# Altium schematic sheet 4_Drivers.schdoc
size 309 x 223 mm; Symbol: Sheet-Symbol_A4; Device: Sheet-Symbol_A4; Company: EasyEDA.com; Drawed: EasyEDA Pro; Reviewed: EasyEDA Pro; Version: V0.1; Page Size: A4; @Project Name: Robomama_ver000; @Page Count: 5; @Update Date: 2024-01-30; @Create Date: 2024-01-06; @Schematic Name: Robomama_Schematic; Part Number: JLCPCB-002; @Page No: 4; @Page Name: Drivers
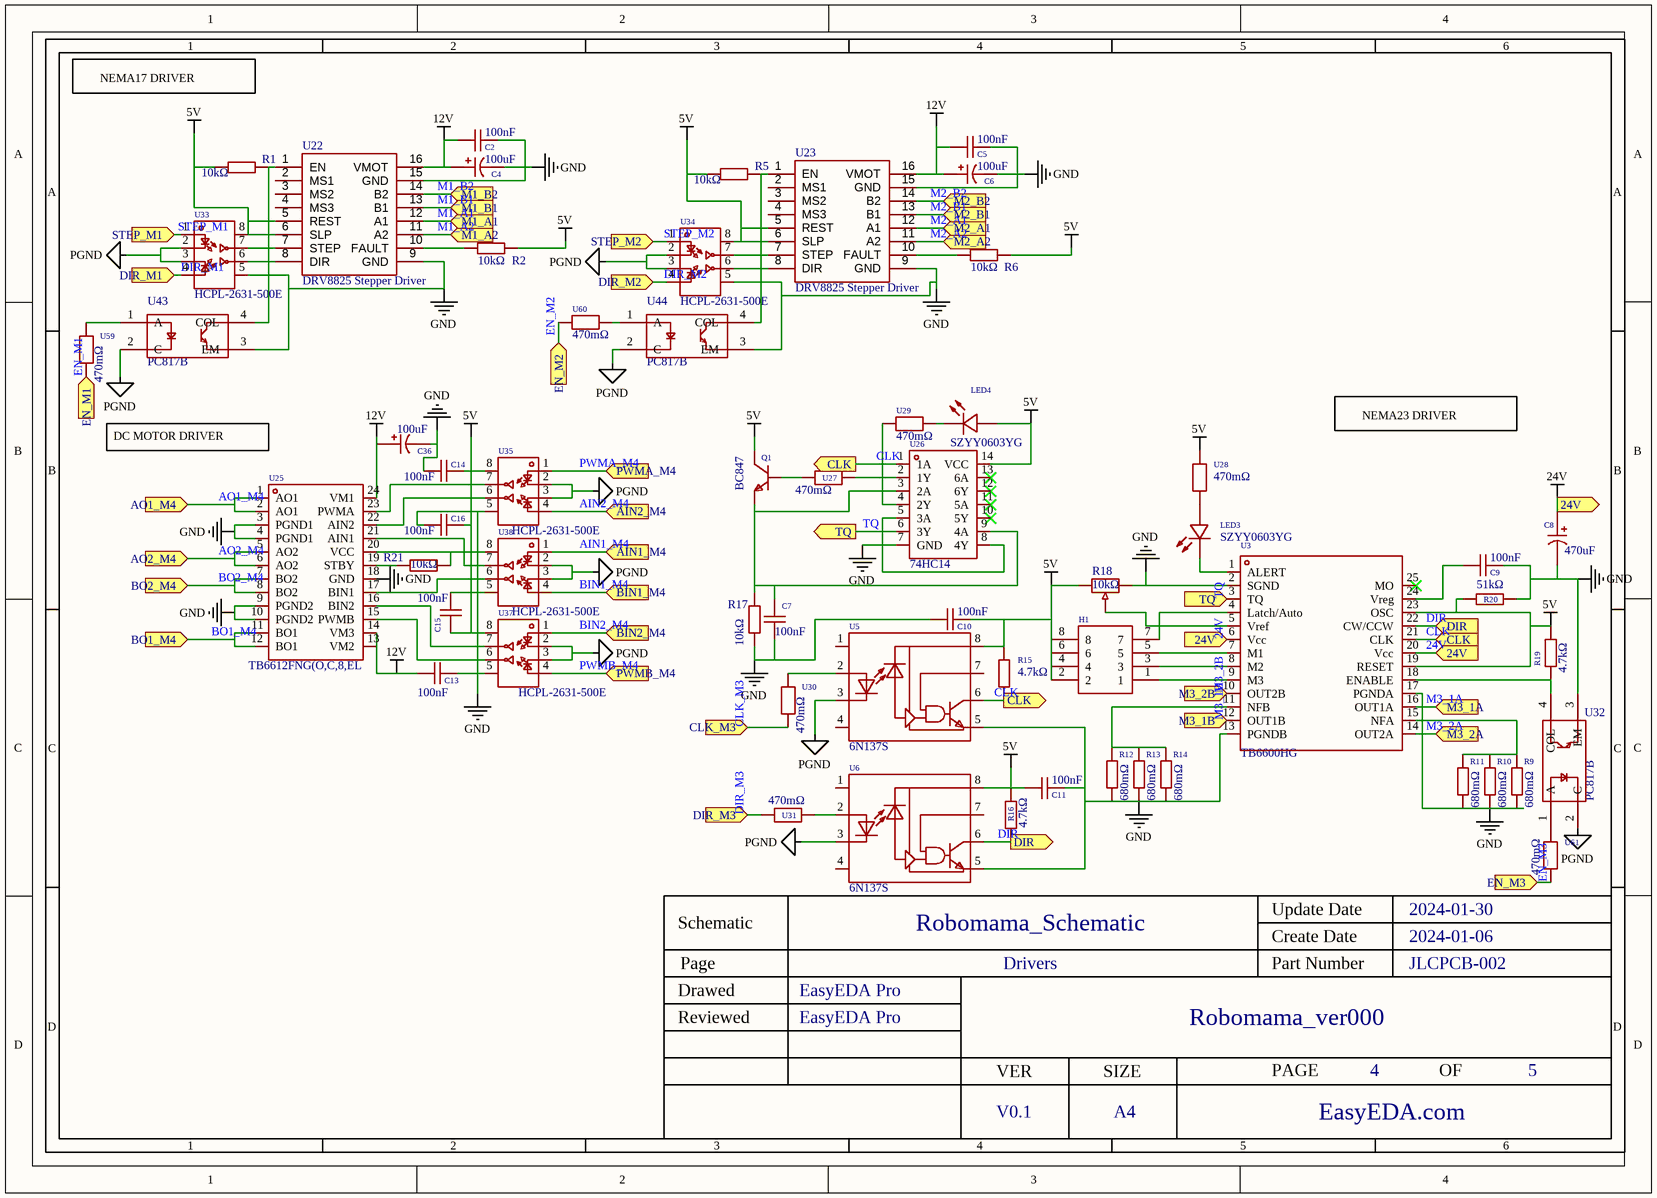
[diagram p0: 4_Drivers.schdoc]

## Parts
C2  100nF  [C0603]  (value not drawn)
C4  100uF  [CAP-SMD_BD6.3-L6.6-W6.6-LS7.2-FD]  (value not drawn)
C5  100nF  [C0603]  (value not drawn)
C6  100uF  [CAP-SMD_BD6.3-L6.6-W6.6-LS7.2-FD]  (value not drawn)
C7  100nF  [C0603]  (value not drawn)
C8  470uF  [CAP-SMD_BD12.5-L13.0-W13.0-LS14.0-FD]  (value not drawn)
C9  100nF  [C0603]  (value not drawn)
C10  100nF  [C0603]  (value not drawn)
C11  100nF  [C0603]  (value not drawn)
C13  100nF  [C0603]  (value not drawn)
C14  100nF  [C0603]  (value not drawn)
C15  100nF  [C0603]  (value not drawn)
C16  100nF  [C0603]  (value not drawn)
C36  100uF  [CAP-SMD_BD6.3-L6.6-W6.6-LS7.2-FD]  (value not drawn)
H1  68602-108HLF  [HDR-TH_8P-P2.54-V-M-R2-C4-S2.54]  (value not drawn)
LED3  SZYY0603YG  [LED0603-R-RD_GREEN]  (value not drawn)
LED4  SZYY0603YG  [LED0603-R-RD_GREEN]  (value not drawn)
Q1  BC847  [SOT-23-3_L2.9-W1.3-P1.90-LS2.4-BR]  (value not drawn)
R1  10kΩ  [R0603]  (value not drawn)
R2  10kΩ  [R0603]  (value not drawn)
R5  10kΩ  [R0603]  (value not drawn)
R6  10kΩ  [R0603]  (value not drawn)
R9  680mΩ  [R1206]  (value not drawn)
R10  680mΩ  [R1206]  (value not drawn)
R11  680mΩ  [R1206]  (value not drawn)
R12  680mΩ  [R1206]  (value not drawn)
R13  680mΩ  [R1206]  (value not drawn)
R14  680mΩ  [R1206]  (value not drawn)
R15  4.7kΩ  [R0402]  (value not drawn)
R16  4.7kΩ  [R0402]  (value not drawn)
R17  10kΩ  [R0603]  (value not drawn)
R18  10kΩ  [RES-ADJ-TH_3P-L9.6-W4.8-P2.50-R]  (value not drawn)
R19  4.7kΩ  [R0402]  (value not drawn)
R20  51kΩ  [R0603]  (value not drawn)
R21  10kΩ  [R0603]  (value not drawn)
U3  TB6600HG  [HZIP25-P-1.0_TB6600HG]  (value not drawn)
U5  6N137S  [SOP-8_L9.8-W6.6-P2.54-LS10.3-BL]  (value not drawn)
U6  6N137S  [SOP-8_L9.8-W6.6-P2.54-LS10.3-BL]  (value not drawn)
U22  DRV8825 Stepper Driver  [DRV8825]  (value not drawn)
U23  DRV8825 Stepper Driver  [DRV8825]  (value not drawn)
U25  TB6612FNG(O,C,8,EL  [SSOP-24_L8.4-W5.8-P0.65-LS7.8-BL]  (value not drawn)
U26  74HC14  [SOIC-14_L8.7-W3.9-P1.27-LS6.0-BL]  (value not drawn)
U27  470mΩ  [R0603]  (value not drawn)
U28  470mΩ  [R0603]  (value not drawn)
U29  470mΩ  [R0603]  (value not drawn)
U30  470mΩ  [R0603]  (value not drawn)
U31  470mΩ  [R0603]  (value not drawn)
U32  PC817B  [OPTO-SMD-4_L4.6-W6.5-P2.54-LS10.3-TL]  (value not drawn)
U33  HCPL-2631-500E  [OPTO-SMD-8P_L9.7-W6.4-P2.54-LS9.7-BL]  (value not drawn)
U34  HCPL-2631-500E  [OPTO-SMD-8P_L9.7-W6.4-P2.54-LS9.7-BL]  (value not drawn)
U35  HCPL-2631-500E  [OPTO-SMD-8P_L9.7-W6.4-P2.54-LS9.7-BL]  (value not drawn)
U37  HCPL-2631-500E  [OPTO-SMD-8P_L9.7-W6.4-P2.54-LS9.7-BL]  (value not drawn)
U38  HCPL-2631-500E  [OPTO-SMD-8P_L9.7-W6.4-P2.54-LS9.7-BL]  (value not drawn)
U43  PC817B  [OPTO-SMD-4_L4.6-W6.5-P2.54-LS10.3-TL]  (value not drawn)
U44  PC817B  [OPTO-SMD-4_L4.6-W6.5-P2.54-LS10.3-TL]  (value not drawn)
U59  470mΩ  [R0603]  (value not drawn)
U60  470mΩ  [R0603]  (value not drawn)
U61  470mΩ  [R0603]  (value not drawn)

## Ports
24V (in), 24V (out), AIN1_M4 (in), AIN2_M4 (in), AO1_M4 (in), AO2_M4 (in), BIN1_M4 (in), BIN2_M4 (in), BO1_M4 (in), BO2_M4 (in), CLK (in), CLK (out), CLK_M3 (in), DIR (in), DIR (out), DIR_M1 (in), DIR_M2 (in), DIR_M3 (in), EN_M1 (in), EN_M2 (in), EN_M3 (in), M1_A1 (in), M1_A2 (in), M1_B1 (in), M1_B2 (in), M2_A1 (in), M2_A2 (in), M2_B1 (in), M2_B2 (in), M3_1A (in), M3_1B (in), M3_2A (in), M3_2B (in), PWMA_M4 (in), PWMB_M4 (in), STEP_M1 (in), STEP_M2 (in), TQ (in), TQ (out)

## Nets
5V: C10.2 C11.1 C14.2 C15.2 C16.2 H1.2 H1.4 H1.6 H1.8 LED4.1(+) Q1.3(C) R1.2 R2.1 R5.2 R6.1 R15.2 R16.2 R18.3 R19.2 R20.2 R21.1 U3.19(RESET) U3.23(OSC) U5.8 U6.8 U22.5(REST) U22.6(SLP) U23.5(REST) U23.6(SLP) U25.20(VCC) U26.14(VCC) U28.2 U33.8(VCC) U34.8(VCC) U35.8(VCC) U37.8(VCC) U38.8(VCC)
12V: C2.1 C4.1 C5.1 C6.1 C13.1 C36.1 U22.16(VMOT) U23.16(VMOT) U25.13(VM2) U25.14(VM3) U25.24(VM1)
24V: C8.1 U3.6(Vcc) U3.20(Vcc) ; port 24V
GND: C2.2 C4.2 C5.2 C6.2 C7.1 C8.2 C9.2 C10.1 C11.2 C13.2 C14.1 C15.1 C16.1 C36.2 R9.1 R10.1 R11.1 R12.1 R13.1 R14.1 R17.2 R18.1 R20.1 U3.2(SGND) U3.13(PGNDB) U3.17(PGNDA) U5.5 U6.5 U22.9(GND) U22.15(GND) U23.9(GND) U23.15(GND) U25.3(PGND1) U25.4(PGND1) U25.9(PGND2) U25.10(PGND2) U25.18(GND) U26.7(GND) U32.3(EM) U33.5(GND) U34.5(GND) U35.5(GND) U37.5(GND) U38.5(GND) U43.3(EM) U44.3(EM)
PGND: U5.3 U6.3 U32.2(C) U33.2(CATHODE_1) U33.3(CATHODE_2) U34.2(CATHODE_1) U34.3(CATHODE_2) U35.2(CATHODE_1) U35.3(CATHODE_2) U37.2(CATHODE_1) U37.3(CATHODE_2) U38.2(CATHODE_1) U38.3(CATHODE_2) U43.2(C) U44.2(C)
AIN1_M4: U38.1(ANODE_1) ; port AIN1_M4
AIN2_M4: U35.4(ANODE_2) ; port AIN2_M4
AO1_M4: U25.1(AO1) U25.2(AO1) ; port AO1_M4
AO2_M4: U25.5(AO2) U25.6(AO2) ; port AO2_M4
BIN1_M4: U38.4(ANODE_2) ; port BIN1_M4
BIN2_M4: U37.1(ANODE_1) ; port BIN2_M4
BO1_M4: U25.11(BO1) U25.12(BO1) ; port BO1_M4
BO2_M4: U25.7(BO2) U25.8(BO2) ; port BO2_M4
CLK: R15.1 U3.21(CLK) U5.6 U26.1(1A) ; port CLK
CLK_M3: U30.2 ; port CLK_M3
DIR: R16.1 U3.22(CW/CCW) U6.6 ; port DIR
DIR_M1: U33.4(ANODE_2) ; port DIR_M1
DIR_M2: U34.4(ANODE_2) ; port DIR_M2
DIR_M3: U31.2 ; port DIR_M3
EN_M1: U59.2 ; port EN_M1
EN_M2: U60.1 ; port EN_M2
EN_M3: U61.2 ; port EN_M3
M1_A1: U22.12(A1) ; port M1_A1
M1_A2: U22.11(A2) ; port M1_A2
M1_B1: U22.13(B1) ; port M1_B1
M1_B2: U22.14(B2) ; port M1_B2
M2_A1: U23.12(A1) ; port M2_A1
M2_A2: U23.11(A2) ; port M2_A2
M2_B1: U23.13(B1) ; port M2_B1
M2_B2: U23.14(B2) ; port M2_B2
M3_1A: U3.16(OUT1A) ; port M3_1A
M3_1B: U3.12(OUT1B) ; port M3_1B
M3_2A: U3.14(OUT2A) ; port M3_2A
M3_2B: U3.10(OUT2B) ; port M3_2B
PWMA_M4: U35.1(ANODE_1) ; port PWMA_M4
PWMB_M4: U37.4(ANODE_2) ; port PWMB_M4
STEP_M1: U33.1(ANODE_1) ; port STEP_M1
STEP_M2: U34.1(ANODE_1) ; port STEP_M2
TQ: U3.3(TQ) U26.6(3Y) ; port TQ
NetC7_2: C7.2 Q1.2(E) R17.1 U26.3(2A) U26.9(4A)
NetC9_1: C9.1 U3.24(Vreg)
NetH1_1: H1.1 U3.9(M3)
NetH1_3: H1.3 U3.8(M2)
NetH1_5: H1.5 U3.7(M1)
NetH1_7: H1.7 U3.4(Latch/Auto)
NetLED3_1: LED3.1(+) U28.1
NetLED3_2: LED3.2(-) U3.1(ALERT)
NetLED4_2: LED4.2(-) U29.2
NetQ1_1: Q1.1(B) U27.1
NetR1_1: R1.1 U22.1(EN) U43.4(COL)
NetR2_2: R2.2 U22.10(FAULT)
NetR5_1: R5.1 U23.1(EN) U44.4(COL)
NetR6_2: R6.2 U23.10(FAULT)
NetR9_2: R9.2 R10.2 R11.2 U3.15(NFA)
NetR12_2: R12.2 R13.2 R14.2 U3.11(NFB)
NetR18_2: R18.2 U3.5(Vref)
NetR19_1: R19.1 U3.18(ENABLE) U32.4(COL)
NetR21_2: R21.2 U25.19(STBY)
NetU5_2: U5.2 U30.1
NetU6_2: U6.2 U31.1
NetU22_7: U22.7(STEP) U33.7(VO1)
NetU22_8: U22.8(DIR) U33.6(VO2)
NetU23_7: U23.7(STEP) U34.7(VO1)
NetU23_8: U23.8(DIR) U34.6(VO2)
NetU25_15: U25.15(PWMB) U37.6(VO2)
NetU25_16: U25.16(BIN2) U37.7(VO1)
NetU25_17: U25.17(BIN1) U38.6(VO2)
NetU25_21: U25.21(AIN1) U38.7(VO1)
NetU25_22: U25.22(AIN2) U35.6(VO2)
NetU25_23: U25.23(PWMA) U35.7(VO1)
NetU26_2: U26.2(1Y) U27.2
NetU26_4: U26.4(2Y) U29.1
NetU26_5: U26.5(3A) U26.8(4Y)
NetU32_1: U32.1(A) U61.1
NetU43_1: U43.1(A) U59.1
NetU44_1: U44.1(A) U60.2

Not connected (* = marked no-connect by the designer): U3 25(MO)*; U5 1 4 7; U6 1 4 7; U22 2(MS1) 3(MS2) 4(MS3); U23 2(MS1) 3(MS2) 4(MS3); U26 10(5Y)* 11(5A)* 12(6Y)* 13(6A)*

## Notes on the sheet
- NEMA17 DRIVER
- DC MOTOR DRIVER
- NEMA23 DRIVER
- 1
- 2
- 3
- 4
- 5
- 6
- A
- B
- C
- Schematic
- Robomama_Schematic
- Create Date
- Update Date
- 2024-01-30
- 2024-01-06
- Reviewed
- Drawed
- Page
- EasyEDA Pro
- Drivers
- Part Number
- Robomama_ver000
- JLCPCB-002
- D
- VER
- SIZE
- PAGE
- OF
- V0.1
- A4
- EasyEDA.com

## Library data of the parts
C2 C5 C7 C9-C11 C13-C16 = 0603B104K500NT_C30926: Capacitance: Tolerance:±10% Tolerance:±10% Voltage Rated: Temperature Coefficient:; Manufacturer: FH(风华); Add into BOM: yes; Tolerance: ±10%; Symbol: 0603B104K500NT; Device: 0603B104K500NT_C30926; Supplier: LCSC; Manufacturer Part: 0603B104K500NT; Value: 100nF; Supplier Part: C30926; JLCPCB Part Class: Extended Part; LCSC Part Name: 100nF ±10% 50V; Supplier Footprint: 0603; Datasheet: https://atta.szlcsc.com/upload/public/pdf/source/20200305/C486355_26A10D38EF8C2A5C37091D0039909270.pdf; Convert to PCB: yes
C4 C6 C36 = RST100UF25V006: Capacitance: Tolerance:±20% Tolerance:±20% Rated Voltage: Ripple Current:91mA@120Hz Equivalent Series Resistance(ESR):- φD: L: Lifetime @ Temp:2000hrs@105℃ Operating Temperature:-40℃~+105℃ Operating Temperature:-40℃~+105℃; Manufacturer: KNSCHA(科尼盛); Add into BOM: yes; Tolerance: ±20%; Symbol: RST100UF25V006; Device: RST100UF25V006; Supplier: LCSC; Supplier Part: C4747965; Manufacturer Part: RST100UF25V006; Value: 100uF; JLCPCB Part Class: Extended Part; LCSC Part Name: 100uF ±20% 25V; Supplier Footprint: SMD,D6.3xL7.7mm; Datasheet: https://atta.szlcsc.com/upload/public/pdf/source/20220727/EEA7BBD00EEFEC885342315615EB9606.pdf; Convert to PCB: yes; Ripple Current: 91mA@120Hz; Equivalent Series Resistance(ESR): -; Lifetime @ Temp: 2000hrs@105℃; Operating Temperature: -40℃~+105℃
C8 = RVT470UF50V34RV0133: Capacitance: Tolerance:±20% Tolerance:±20% Rated Voltage: Ripple Current:50mA@120Hz Equivalent Series Resistance(ESR):- φD: L: Lifetime @ Temp:2000hrs@105℃ Operating Temperature:-55℃~+105℃ Operating Temperature:-55℃~+105℃; Manufacturer: KNSCHA(科尼盛); Add into BOM: yes; Tolerance: ±20%; Symbol: RVT470UF50V34RV0133; Device: RVT470UF50V34RV0133; Supplier: LCSC; Supplier Part: C2837182; Manufacturer Part: RVT470UF50V34RV0133; Value: 470uF; JLCPCB Part Class: Extended Part; LCSC Part Name: 470uF ±20% 50V; Supplier Footprint: SMD,D12.5xL13.5mm; Datasheet: https://atta.szlcsc.com/upload/public/pdf/source/20210603/C2837182_E1DEB959C7A33C0F917E27B2DE8CCF98.pdf; Convert to PCB: yes; Ripple Current: 50mA@120Hz; Equivalent Series Resistance(ESR): -; Lifetime @ Temp: 2000hrs@105℃; Operating Temperature: -55℃~+105℃
H1 = 68602-108HLF: Number of Rows:双排 Number of Pins:8P Pitch:2.54mm Pin Structure:- Row Spacing:2.54mm Mounting Type:Straight Circluar Pins/Square Pins:Square Pins Current Rating (Max):3A Voltage Rating (Max):- Length of Mating Pin:- Insulation Height:2.54mm Contact Materia; Manufacturer: Amphenol; Add into BOM: yes; Pitch: 2.54mm; Current Rating (Max): 3A; Symbol: 68602-108HLF; Device: 68602-108HLF; Supplier: LCSC; Supplier Part: C168672; Manufacturer Part: 68602-108HLF; JLCPCB Part Class: Extended Part; LCSC Part Name: 间距:2.54mm 直插 方针; Supplier Footprint: 插件,P=2.54mm; Datasheet: https://atta.szlcsc.com/upload/public/pdf/source/20191127/C464650_066E720E4CFFE92A9C66644EF910F1DF.pdf; Convert to PCB: yes; Number of Rows: 双排; Number of Pins: 8P; Pin Structure: -; Row Spacing: 2.54mm; Mounting Type: Straight; Circluar Pins/Square Pins: Square Pins; Voltage Rating (Max): -; Length of Mating Pin: -; Insulation Height: 2.54mm; Contact Plating: -; Operating Temperature Range: -65℃~+130℃; Color: Black
LED3 LED4 = SZYY0603YG: Emitted Color:Green-yellow; Manufacturer: yongyu(永裕光电); Add into BOM: yes; Symbol: SZYY0603YG; Device: SZYY0603YG; Supplier: LCSC; Supplier Part: C434423; Manufacturer Part: SZYY0603YG; JLCPCB Part Class: Extended Part; LCSC Part Name: 普绿/黄绿; Supplier Footprint: 0603; Datasheet: https://atta.szlcsc.com/upload/public/pdf/source/20191204/C434423_A1540F327AC0495CFC4F5F4A5CB9D8CC.pdf; Convert to PCB: yes; Emitted Color: Green-yellow
Q1 = BC847_C475630: Transistor Type: Collector Current (Ic): Collector-Emitter Breakdown Voltage (Vceo): Power Dissipation (Pd): Transition Frequency (fT):100MHz Collector Cut-Off Current (Icbo):100nA Collector-Emitter Saturation Voltage (VCE(sat)@Ic,Ib):500mV@100mA,5mA Oper; Manufacturer: SHIKUES(时科); Add into BOM: yes; Transition Frequency (fT): 100MHz; Collector Cut-Off Current (Icbo): 100nA; Symbol: BC847_C475630; Device: BC847_C475630; Supplier: LCSC; Supplier Part: C475630; Manufacturer Part: BC847; JLCPCB Part Class: Extended Part; LCSC Part Name: NPN 电流:100mA 耐压:45V; Supplier Footprint: SOT-23; Datasheet: https://atta.szlcsc.com/upload/public/pdf/source/20200102/C475632_1BD5CEE5FD46587CE970DDC94CF96264.pdf; Convert to PCB: yes; Collector-Emitter Saturation Voltage (VCE(sat)@Ic,Ib): 500mV@100mA,5mA; Operating Temperature: -
R1 R2 R5 R6 R17 R21 = RC0603FR-0710KL: Type:Thick Film Resistors Resistance: Tolerance:±1% Tolerance:±1% Power(Watts): Temperature Coefficient:±100ppm/℃ Temperature Coefficient:±100ppm/℃ Overload Voltage (Max): Operating Temperature Range:-55℃~+155℃ Operating Temperature Range:-55℃~+155℃; Manufacturer: YAGEO(国巨); Add into BOM: yes; Tolerance: ±1%; Symbol: RC0603FR-0710KL; Device: RC0603FR-0710KL; LCSC Part Name: 10kΩ ±1% 100mW; Supplier Part: C98220; Manufacturer Part: RC0603FR-0710KL; Supplier Footprint: 0603; JLCPCB Part Class: Extended Part; Datasheet: https://atta.szlcsc.com/upload/public/pdf/source/20170522/1495423494387.pdf; Supplier: LCSC; Convert to PCB: yes; Type: Thick Film Resistors; Value: 10kΩ; Temperature Coefficient: ±100ppm/℃; Operating Temperature Range: -55℃~+155℃
R9-R14 = 1206W4F680LT5E: Resistance:680mΩ Tolerance:±1% Tolerance:±1% Power(Watts): Overload Voltage (Max): Temperature Coefficient:±800ppm/℃ Temperature Coefficient:±800ppm/℃ Type:Thick Film Resistors Operating Temperature Range:-55℃~+155℃ Operating Temperature Range:-55℃~+155℃; Manufacturer: UNI-ROYAL(厚声); Add into BOM: yes; Tolerance: ±1%; Symbol: 1206W4F680LT5E; Device: 1206W4F680LT5E; Supplier: LCSC; Manufacturer Part: 1206W4F680LT5E; Supplier Part: C19108; Value: 680mΩ; JLCPCB Part Class: Extended Part; LCSC Part Name: 680mΩ ±1% 250mW 厚膜电阻; Supplier Footprint: 1206; Datasheet: https://atta.szlcsc.com/upload/public/pdf/source/20200306/C422600_1E6D84923E4A46A82E41ADD87F860B5C.pdf; Convert to PCB: yes; Temperature Coefficient: ±800ppm/℃; Type: Thick Film Resistors; Operating Temperature Range: -55℃~+155℃
R15 R16 R19 = 0402WGF4701TCE: Resistance:4700Ω Tolerance:±1% Tolerance:±1% Power(Watts): Overload Voltage (Max): Temperature Coefficient:±100ppm/℃ Temperature Coefficient:±100ppm/℃ Type:Thick Film Resistors Operating Temperature Range:-55℃~+155℃ Operating Temperature Range:-55℃~+155℃; Manufacturer: UNI-ROYAL(厚声); Add into BOM: yes; Tolerance: ±1%; Symbol: 0402WGF4701TCE; Device: 0402WGF4701TCE; Supplier: LCSC; Manufacturer Part: 0402WGF4701TCE; Supplier Part: C25900; Value: 4.7kΩ; JLCPCB Part Class: Basic Part; LCSC Part Name: 4.7kΩ ±1% 62.5mW 厚膜电阻; Supplier Footprint: 0402; Datasheet: https://atta.szlcsc.com/upload/public/pdf/source/20200306/C422600_1E6D84923E4A46A82E41ADD87F860B5C.pdf; Convert to PCB: yes; Temperature Coefficient: ±100ppm/℃; Type: Thick Film Resistors; Operating Temperature Range: -55℃~+155℃
R18 = CT-94EX 10K OHM (103): Resistance: Tolerance:±10% Tolerance:±10%; Manufacturer: COPAL(科宝电子); Add into BOM: yes; Tolerance: ±10%; Symbol: CT-94EX 10K OHM (103); Device: CT-94EX 10K OHM (103); LCSC Part Name: 10kΩ ±10%; Supplier Part: C132868; Manufacturer Part: CT-94EX 10K OHM (103); Supplier Footprint: 插件; JLCPCB Part Class: Extended Part; Datasheet: https://atta.szlcsc.com/upload/public/pdf/source/20170930/C132868_1506736314192997221.pdf; Supplier: LCSC; Convert to PCB: yes; Value: 10kΩ
R20 = 0603WAF5102T5E: Resistance:51000Ω Tolerance:±1% Tolerance:±1% Power(Watts): Overload Voltage (Max): Temperature Coefficient:±100ppm/℃ Temperature Coefficient:±100ppm/℃ Type:Thick Film Resistors Operating Temperature Range:-55℃~+155℃ Operating Temperature Range:-55℃~+155℃; Manufacturer: UNI-ROYAL(厚声); Add into BOM: yes; Tolerance: ±1%; Symbol: 0603WAF5102T5E; Device: 0603WAF5102T5E; Supplier: LCSC; Manufacturer Part: 0603WAF5102T5E; Supplier Part: C23196; Value: 51kΩ; JLCPCB Part Class: Basic Part; LCSC Part Name: 51kΩ ±1% 100mW 厚膜电阻; Supplier Footprint: 0603; Datasheet: https://atta.szlcsc.com/upload/public/pdf/source/20200306/C422600_1E6D84923E4A46A82E41ADD87F860B5C.pdf; Convert to PCB: yes; Temperature Coefficient: ±100ppm/℃; Type: Thick Film Resistors; Operating Temperature Range: -55℃~+155℃
U3 = TB6600HG: Type:- Supply Voltage:8V~42V Supply Voltage:8V~42V Output Current:4.5A Interface:Parallel Operating Temperature:-30℃~+85℃@(Ta) Operating Temperature:-30℃~+85℃@(Ta); Manufacturer: TOSHIBA(东芝); Add into BOM: yes; Supply Voltage: 8V~42V; Output Current: 4.5A; Symbol: TB6600HG; Device: TB6600HG; Supplier: LCSC; Manufacturer Part: TB6600HG; Supplier Part: C66042; JLCPCB Part Class: Extended Part; LCSC Part Name: 4.5A 42V电机驱动芯片; Supplier Footprint: HZIP-25-P-1mm; Datasheet: https://atta.szlcsc.com/upload/public/pdf/source/20170511/1494500127812.pdf; Convert to PCB: yes; Type: -; Interface: Parallel; Operating Temperature: -30℃~+85℃@(Ta)
U5 U6 = 6N137S: Input Type:DC Supply Voltage:4.5V~5.5V；2.7V~3.6V Supply Voltage:4.5V~5.5V；2.7V~3.6V Isolation Voltage(rms):5000V Common Mode Transient Immunity (CMTI):- Data Rate:10Mbit/s Propagation Delay tpLH/tpHL:75ns；75ns Number of Channels:1 Operating Temperature:-5; Manufacturer: Slkor(萨科微); Add into BOM: yes; Input Type: DC; Isolation Voltage(rms): 5000V; Number of Channels: 1; Symbol: 6N137S; Device: 6N137S; Supplier: LCSC; Supplier Part: C2918951; Manufacturer Part: 6N137S; JLCPCB Part Class: Extended Part; LCSC Part Name: DC输入 1通道 隔离电压(rms):5000V; Supplier Footprint: SOP-8-2.54mm; Datasheet: https://atta.szlcsc.com/upload/public/pdf/source/20221025/B77DBF7347B36F1759FE2FF64F159AA9.pdf; Convert to PCB: yes; Supply Voltage: 4.5V~5.5V；2.7V~3.6V; Common Mode Transient Immunity (CMTI): -; Data Rate: 10Mbit/s; Propagation Delay tpLH/tpHL: 75ns；75ns; Operating Temperature: -55℃~+100℃
U22 U23 = DRV8825 Stepper Driver: Manufacturer: Pololu; Add into BOM: yes; Symbol: DRV8825 Stepper Driver; Device: DRV8825 Stepper Driver; Convert to PCB: yes; Manufacturer Part: DRV8825; Supplier Part: DRV8825
U25 = TB6612FNG(O,C,8,EL: Manufacturer: TOSHIBA(东芝); Add into BOM: yes; Symbol: TB6612FNG(O,C,8,EL; Device: TB6612FNG(O,C,8,EL; Supplier: LCSC; Manufacturer Part: TB6612FNG(O,C,8,EL; Supplier Part: C88224; JLCPCB Part Class: Extended Part; LCSC Part Name: TB6612FNG(O,C,8,EL; Supplier Footprint: SSOP-24-208mil; Datasheet: https://atta.szlcsc.com/upload/public/pdf/source/20171128/C141517_15118625624231147036.pdf; Convert to PCB: yes
U26 = 74HC14_C5356103: Manufacturer: JSMSEMI(杰盛微); Add into BOM: yes; Symbol: 74HC14_C5356103; Device: 74HC14_C5356103; Supplier: LCSC; Supplier Part: C5356103; Manufacturer Part: 74HC14; JLCPCB Part Class: Extended Part; LCSC Part Name: 74HC14; Supplier Footprint: SOP-14; Datasheet: https://atta.szlcsc.com/upload/public/pdf/source/20230209/4C109757DB9876D93BFDDA805285E2B5.pdf; Convert to PCB: yes
U27-U31 U59-U61 = FRL0603FR470TS: Resistance: Tolerance:±1% Tolerance:±1% Power(Watts): Overload Voltage (Max): Temperature Coefficient:±300ppm/℃ Temperature Coefficient:±300ppm/℃ Type:Thick Film Resistors; Manufacturer: FOJAN(富捷); Add into BOM: yes; Tolerance: ±1%; Symbol: FRL0603FR470TS; Device: FRL0603FR470TS; Supplier: LCSC; Supplier Part: C3013349; Manufacturer Part: FRL0603FR470TS; Value: 470mΩ; JLCPCB Part Class: Extended Part; LCSC Part Name: 470mΩ ±1% 100mW 厚膜电阻; Supplier Footprint: 0603; Datasheet: https://atta.szlcsc.com/upload/public/pdf/source/20211221/925EC7D7225764EE0046F22065062C87.pdf; Convert to PCB: yes; Temperature Coefficient: ±300ppm/℃; Type: Thick Film Resistors
U32 U43 U44 = PC817B_C3025163: Manufacturer: GOODWORK(固得沃克); Symbol: PC817B_C3025163-1; Add into BOM: yes; Device: PC817B_C3025163; LCSC Part Name: B档; Supplier Part: C3025163; Manufacturer Part: PC817B; Supplier Footprint: SMD-4P; JLCPCB Part Class: Extended Part; Datasheet: https://atta.szlcsc.com/upload/public/pdf/source/20220530/3FD5D572B823BA05C967330A07ECF74F.pdf; Supplier: LCSC; Convert to PCB: yes
U33-U35 U37 U38 = HCPL-2631-500E: Input Type:DC Supply Voltage:4.5V~5.5V Supply Voltage:4.5V~5.5V Isolation Voltage(rms):3750V Common Mode Transient Immunity (CMTI):10kV/us Data Rate:10Mbit/s Propagation Delay tpLH/tpHL:100ns；100ns Number of Channels:2 Operating Temperature:-40℃~+85℃ Oper; Manufacturer: Broadcom/AVAGO(安华高); Add into BOM: yes; Input Type: DC; Isolation Voltage(rms): 3750V; Number of Channels: 2; Symbol: HCPL-2631-500E; Device: HCPL-2631-500E; Supplier: LCSC; Supplier Part: C188742; Manufacturer Part: HCPL-2631-500E; JLCPCB Part Class: Extended Part; LCSC Part Name: DC输入 2通道 隔离电压(rms):3750V; Supplier Footprint: SMD-8; Datasheet: https://atta.szlcsc.com/upload/public/pdf/source/20230529/B66ECE73AA068C74D68BEC5BB0D87132.pdf; Convert to PCB: yes; Supply Voltage: 4.5V~5.5V; Common Mode Transient Immunity (CMTI): 10kV/us; Data Rate: 10Mbit/s; Propagation Delay tpLH/tpHL: 100ns；100ns; Operating Temperature: -40℃~+85℃